# Altium schematic sheet dali_phy_blk.SchDoc
size A4; Engineer: JBayalas; DocumentNumber: 14; Revision: V4.3.0; SheetNumber: 14; SheetTotal: 14
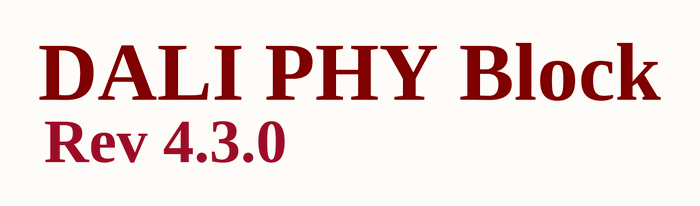
[diagram p0: dali_phy_blk.SchDoc]

## Notes on the sheet
- DALI PHY Block
- Rev 4.3.0
- Title:
- Sheet:
- Date:
- of
- Project:
- Revision:
- Engineer:
- Wi4B S.r.l